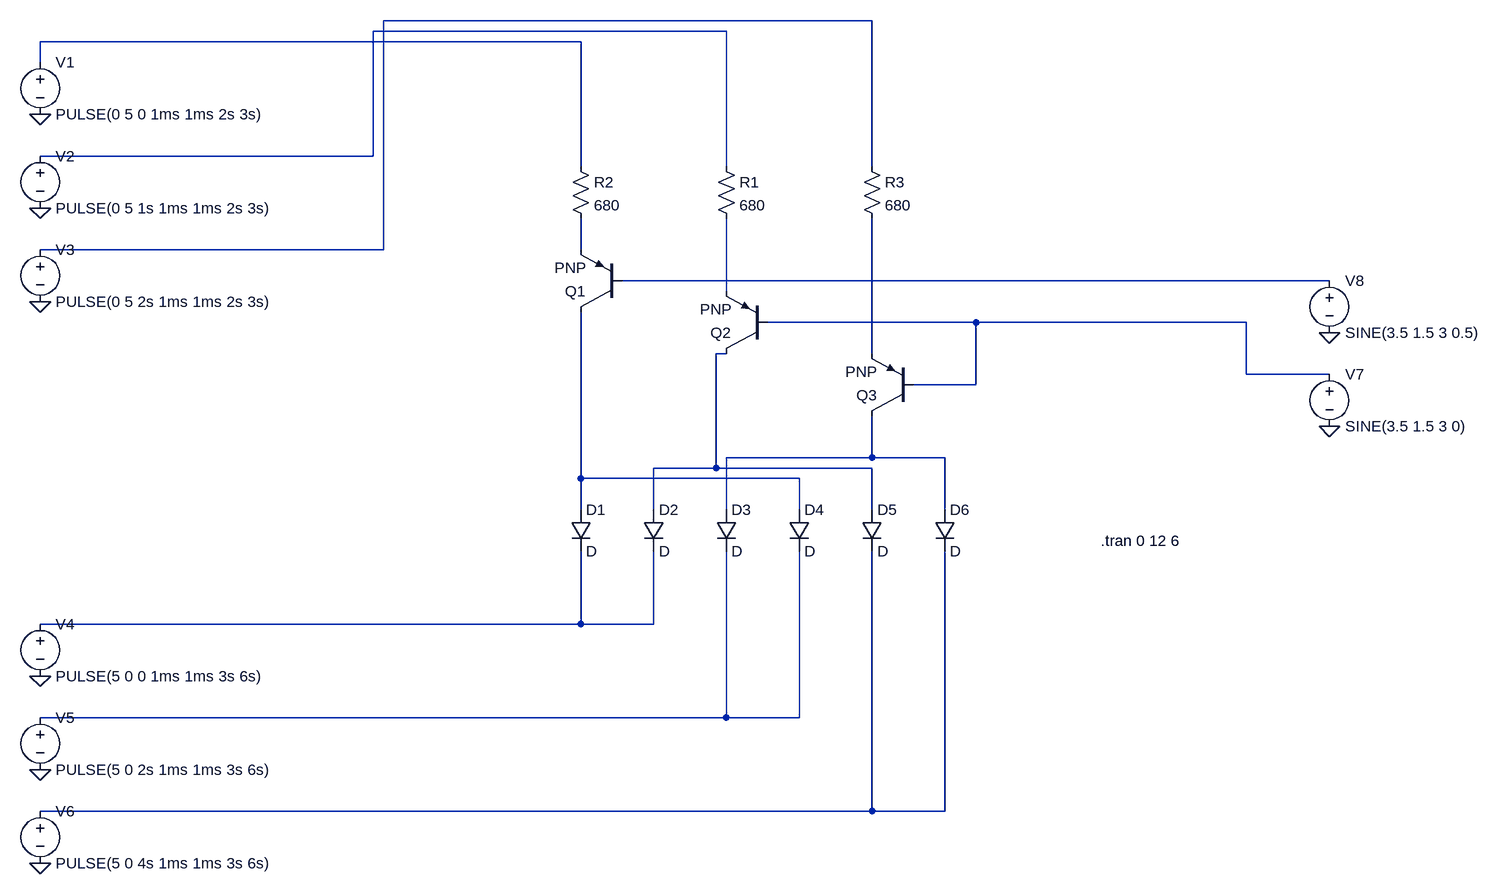
[diagram p0: schematic synchroscope-leds.asc]
synchroscope-leds.asc, the LTspice schematic file:
Version 4
SHEET 1 1884 680
WIRE 192 -672 -560 -672
WIRE -32 -656 -576 -656
WIRE -256 -640 -1088 -640
WIRE -1088 -608 -1088 -640
WIRE -576 -464 -576 -656
WIRE -576 -464 -1088 -464
WIRE -256 -448 -256 -640
WIRE -32 -448 -32 -656
WIRE 192 -448 192 -672
WIRE -560 -320 -560 -672
WIRE -560 -320 -1088 -320
WIRE -256 -320 -256 -368
WIRE 896 -272 -192 -272
WIRE -32 -256 -32 -368
WIRE 352 -208 32 -208
WIRE 768 -208 352 -208
WIRE -32 -160 -48 -160
WIRE 192 -160 192 -368
WIRE 768 -128 768 -208
WIRE 896 -128 768 -128
WIRE 352 -112 352 -208
WIRE 352 -112 256 -112
WIRE 192 0 192 -64
WIRE 192 0 -32 0
WIRE 304 0 192 0
WIRE -48 16 -48 -160
WIRE -48 16 -144 16
WIRE 192 16 -48 16
WIRE -256 32 -256 -224
WIRE 80 32 -256 32
WIRE -256 80 -256 32
WIRE -144 80 -144 16
WIRE -32 80 -32 0
WIRE 80 80 80 32
WIRE 192 80 192 16
WIRE 304 80 304 0
WIRE -256 256 -256 144
WIRE -256 256 -1088 256
WIRE -144 256 -144 144
WIRE -144 256 -256 256
WIRE -32 400 -32 144
WIRE -32 400 -1088 400
WIRE 80 400 80 144
WIRE 80 400 -32 400
WIRE 192 544 192 144
WIRE 192 544 -1088 544
WIRE 304 544 304 144
WIRE 304 544 192 544
FLAG -1088 624 0
FLAG -1088 480 0
FLAG -1088 336 0
FLAG -1088 -240 0
FLAG -1088 -384 0
FLAG -1088 -528 0
FLAG 896 -48 0
FLAG 896 -192 0
SYMBOL voltage -1088 -624 R0
WINDOW 123 0 0 Left 2
WINDOW 39 0 0 Left 2
SYMATTR InstName V1
SYMATTR Value PULSE(0 5 0 1ms 1ms 2s 3s)
SYMBOL voltage -1088 -480 R0
WINDOW 123 0 0 Left 2
WINDOW 39 0 0 Left 2
SYMATTR InstName V2
SYMATTR Value PULSE(0 5 1s 1ms 1ms 2s 3s)
SYMBOL voltage -1088 -336 R0
WINDOW 123 0 0 Left 2
WINDOW 39 0 0 Left 2
SYMATTR InstName V3
SYMATTR Value PULSE(0 5 2s 1ms 1ms 2s 3s)
SYMBOL voltage -1088 240 R0
WINDOW 123 0 0 Left 2
WINDOW 39 0 0 Left 2
SYMATTR InstName V4
SYMATTR Value PULSE(5 0 0 1ms 1ms 3s 6s)
SYMBOL voltage -1088 384 R0
WINDOW 123 0 0 Left 2
WINDOW 39 0 0 Left 2
SYMATTR InstName V5
SYMATTR Value PULSE(5 0 2s 1ms 1ms 3s 6s)
SYMBOL voltage -1088 528 R0
WINDOW 123 0 0 Left 2
WINDOW 39 0 0 Left 2
SYMATTR InstName V6
SYMATTR Value PULSE(5 0 4s 1ms 1ms 3s 6s)
SYMBOL diode -272 80 R0
SYMATTR InstName D1
SYMBOL diode -160 80 R0
SYMATTR InstName D2
SYMBOL diode -48 80 R0
SYMATTR InstName D3
SYMBOL diode 64 80 R0
SYMATTR InstName D4
SYMBOL diode 176 80 R0
SYMATTR InstName D5
SYMBOL diode 288 80 R0
SYMATTR InstName D6
SYMBOL pnp -192 -224 R180
SYMATTR InstName Q1
SYMBOL pnp 32 -160 R180
SYMATTR InstName Q2
SYMBOL pnp 256 -64 R180
SYMATTR InstName Q3
SYMBOL res 176 -464 R0
SYMATTR InstName R3
SYMATTR Value 680
SYMBOL res -48 -464 R0
SYMATTR InstName R1
SYMATTR Value 680
SYMBOL res -272 -464 R0
SYMATTR InstName R2
SYMATTR Value 680
SYMBOL voltage 896 -144 R0
WINDOW 123 0 0 Left 2
WINDOW 39 0 0 Left 2
SYMATTR InstName V7
SYMATTR Value SINE(3.5 1.5 3 0)
SYMBOL voltage 896 -288 R0
WINDOW 123 0 0 Left 2
WINDOW 39 0 0 Left 2
SYMATTR InstName V8
SYMATTR Value SINE(3.5 1.5 3 0.5)
TEXT 544 128 Left 2 !.tran 0 12 6

The netlist it stands for:
* synchroscope-leds.asc
V1 N003 0 PULSE(0 5 0 1ms 1ms 2s 3s)
V2 N002 0 PULSE(0 5 1s 1ms 1ms 2s 3s)
V3 N001 0 PULSE(0 5 2s 1ms 1ms 2s 3s)
V4 N012 0 PULSE(5 0 0 1ms 1ms 3s 6s)
V5 N013 0 PULSE(5 0 2s 1ms 1ms 3s 6s)
V6 N014 0 PULSE(5 0 4s 1ms 1ms 3s 6s)
D1 N011 N012 D
D2 N008 N012 D
D3 N010 N013 D
D4 N011 N013 D
D5 N008 N014 D
D6 N010 N014 D
Q1 N011 N005 N004 0 PNP
Q2 N008 N007 N006 0 PNP
Q3 N010 N007 N009 0 PNP
R3 N001 N009 680
R1 N002 N006 680
R2 N003 N004 680
V7 N007 0 SINE(3.5 1.5 3 0)
V8 N005 0 SINE(3.5 1.5 3 0.5)
.model D D
.lib standard.dio
.model NPN NPN
.model PNP PNP
.lib standard.bjt
.tran 0 12 6
.backanno
.end